# Altium schematic sheet 06 ethernet.SchDoc
size A3; SheetNumber: 10; SheetTotal: 16
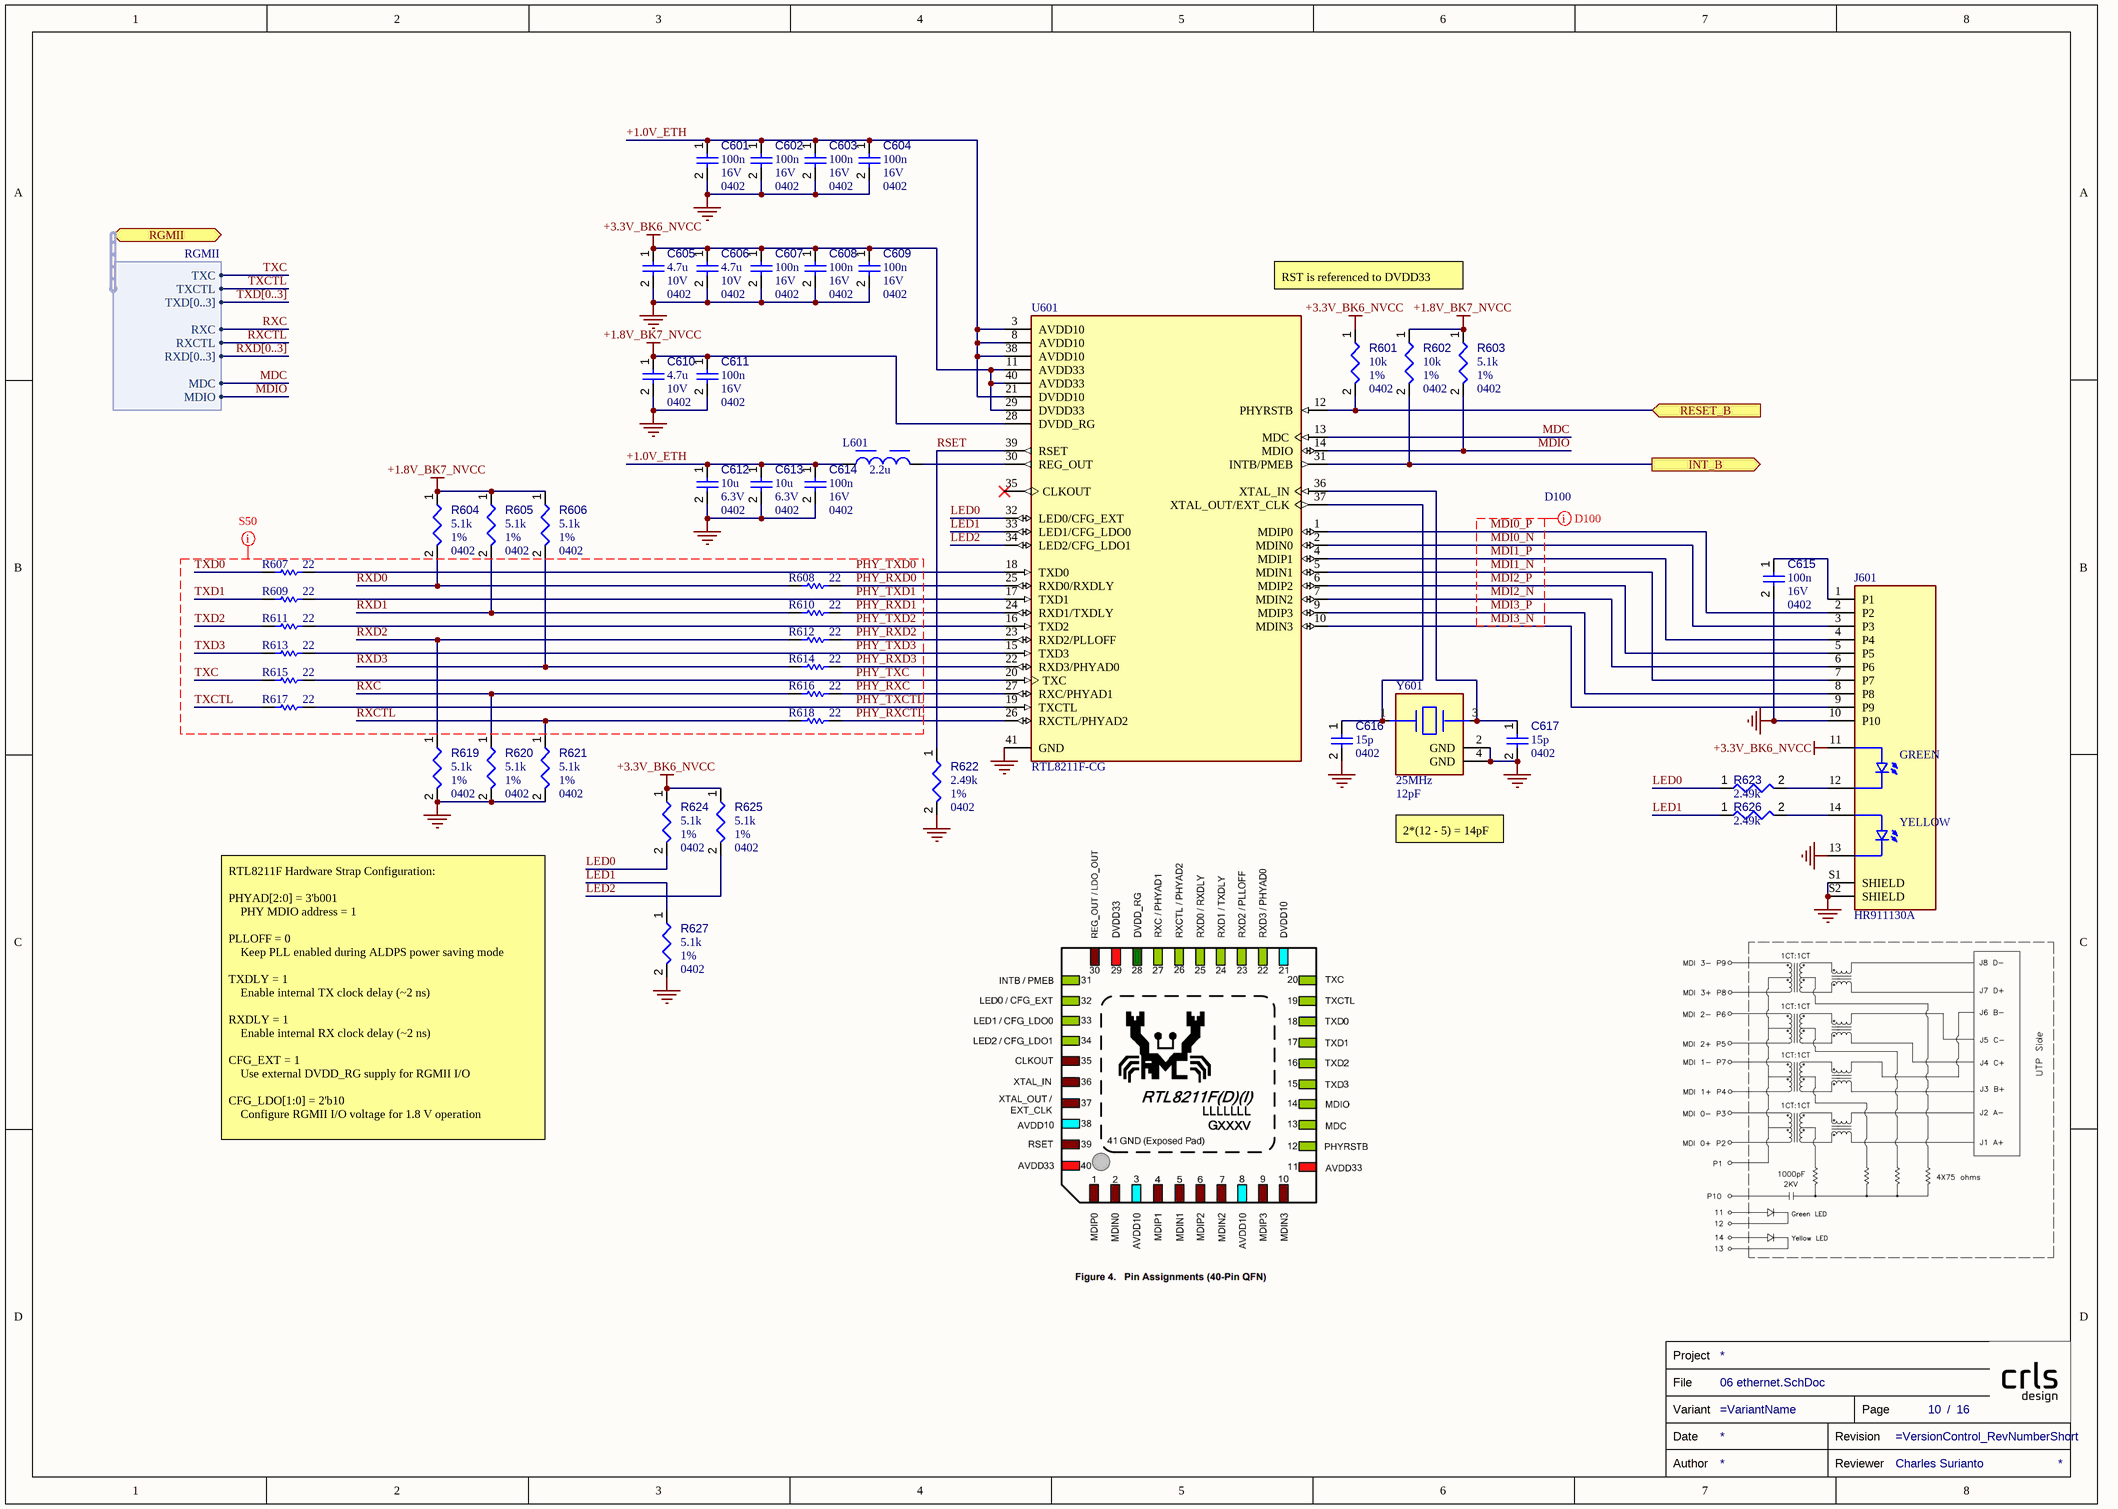
[diagram p0: 06 ethernet.SchDoc]

## Parts
C601  value 100n  Case/Package: 0402  Voltage Rating: 16V  [CAPC0402(1005)60_L]  (hidden comment: Capacitors,0402,100n,16V)
C602  value 100n  Case/Package: 0402  Voltage Rating: 16V  [CAPC0402(1005)60_L]  (hidden comment: Capacitors,0402,100n,16V)
C603  value 100n  Case/Package: 0402  Voltage Rating: 16V  [CAPC0402(1005)60_L]  (hidden comment: Capacitors,0402,100n,16V)
C604  value 100n  Case/Package: 0402  Voltage Rating: 16V  [CAPC0402(1005)60_L]  (hidden comment: Capacitors,0402,100n,16V)
C605  value 4.7u  Case/Package: 0402  Voltage Rating: 10V  [CAPC0402(1005)60_L]  (hidden comment: Capacitors,0402,4.7u,10V)
C606  value 4.7u  Case/Package: 0402  Voltage Rating: 10V  [CAPC0402(1005)60_L]  (hidden comment: Capacitors,0402,4.7u,10V)
C607  value 100n  Case/Package: 0402  Voltage Rating: 16V  [CAPC0402(1005)60_L]  (hidden comment: Capacitors,0402,100n,16V)
C608  value 100n  Case/Package: 0402  Voltage Rating: 16V  [CAPC0402(1005)60_L]  (hidden comment: Capacitors,0402,100n,16V)
C609  value 100n  Case/Package: 0402  Voltage Rating: 16V  [CAPC0402(1005)60_L]  (hidden comment: Capacitors,0402,100n,16V)
C610  value 4.7u  Case/Package: 0402  Voltage Rating: 10V  [CAPC0402(1005)60_L]  (hidden comment: Capacitors,0402,4.7u,10V)
C611  value 100n  Case/Package: 0402  Voltage Rating: 16V  [CAPC0402(1005)60_L]  (hidden comment: Capacitors,0402,100n,16V)
C612  value 10u  Case/Package: 0402  Voltage Rating: 6.3V  [CAPC0402(1005)60_L]  (hidden comment: Capacitors,0402,10u,6.3V)
C613  value 10u  Case/Package: 0402  Voltage Rating: 6.3V  [CAPC0402(1005)60_L]  (hidden comment: Capacitors,0402,10u,6.3V)
C614  value 100n  Case/Package: 0402  Voltage Rating: 16V  [CAPC0402(1005)60_L]  (hidden comment: Capacitors,0402,100n,16V)
C615  value 100n  Case/Package: 0402  Voltage Rating: 16V  [CAPC0402(1005)60_L]  (hidden comment: Capacitors,0402,100n,16V)
C616  value 15p  Case/Package: 0402  [CAPC0402(1005)60_L]  (hidden comment: Capacitors,0402,15p)
C617  value 15p  Case/Package: 0402  [CAPC0402(1005)60_L]  (hidden comment: Capacitors,0402,15p)
J601  HR911130A  [HANRUN_HR911130A]
L601  Inductance: 2.2u  [WE-LQS_3015]  (hidden comment: 74404032022)
R601  value 10k  Case/Package: 0402  Tolerance: 1%  [RESC0402(1005)_L]  (hidden comment: Resistors,0402,1%,10k)
R602  value 10k  Case/Package: 0402  Tolerance: 1%  [RESC0402(1005)_L]  (hidden comment: Resistors,0402,1%,10k)
R603  value 5.1k  Case/Package: 0402  Tolerance: 1%  [RESC0402(1005)_L]  (hidden comment: Resistors,0402,1%,5.1k)
R604  value 5.1k  Case/Package: 0402  Tolerance: 1%  [RESC0402(1005)_L]  (hidden comment: Resistors,0402,1%,5.1k)
R605  value 5.1k  Case/Package: 0402  Tolerance: 1%  [RESC0402(1005)_L]  (hidden comment: Resistors,0402,1%,5.1k)
R606  value 5.1k  Case/Package: 0402  Tolerance: 1%  [RESC0402(1005)_L]  (hidden comment: Resistors,0402,1%,5.1k)
R607  value 22  [RESC0201(0603)_L]  (hidden comment: 22R 1% 0201(0603))
R608  value 22  [RESC0201(0603)_L]  (hidden comment: 22R 1% 0201(0603))
R609  value 22  [RESC0201(0603)_L]  (hidden comment: 22R 1% 0201(0603))
R610  value 22  [RESC0201(0603)_L]  (hidden comment: 22R 1% 0201(0603))
R611  value 22  [RESC0201(0603)_L]  (hidden comment: 22R 1% 0201(0603))
R612  value 22  [RESC0201(0603)_L]  (hidden comment: 22R 1% 0201(0603))
R613  value 22  [RESC0201(0603)_L]  (hidden comment: 22R 1% 0201(0603))
R614  value 22  [RESC0201(0603)_L]  (hidden comment: 22R 1% 0201(0603))
R615  value 22  [RESC0201(0603)_L]  (hidden comment: 22R 1% 0201(0603))
R616  value 22  [RESC0201(0603)_L]  (hidden comment: 22R 1% 0201(0603))
R617  value 22  [RESC0201(0603)_L]  (hidden comment: 22R 1% 0201(0603))
R618  value 22  [RESC0201(0603)_L]  (hidden comment: 22R 1% 0201(0603))
R619  value 5.1k  Case/Package: 0402  Tolerance: 1%  [RESC0402(1005)_L]  (hidden comment: Resistors,0402,1%,5.1k)
R620  value 5.1k  Case/Package: 0402  Tolerance: 1%  [RESC0402(1005)_L]  (hidden comment: Resistors,0402,1%,5.1k)
R621  value 5.1k  Case/Package: 0402  Tolerance: 1%  [RESC0402(1005)_L]  (hidden comment: Resistors,0402,1%,5.1k)
R622  value 2.49k  Case/Package: 0402  Tolerance: 1%  [RESC0402(1005)_L]  (hidden comment: Resistors,0402,1%,2.49k)
R623  value 2.49k  [RESC0402(1005)_L]  (hidden comment: Resistors,0402,1%,2.49k)
R624  value 5.1k  Case/Package: 0402  Tolerance: 1%  [RESC0402(1005)_L]  (hidden comment: Resistors,0402,1%,5.1k)
R625  value 5.1k  Case/Package: 0402  Tolerance: 1%  [RESC0402(1005)_L]  (hidden comment: Resistors,0402,1%,5.1k)
R626  value 2.49k  [RESC0402(1005)_L]  (hidden comment: Resistors,0402,1%,2.49k)
R627  value 5.1k  Case/Package: 0402  Tolerance: 1%  [RESC0402(1005)_L]  (hidden comment: Resistors,0402,1%,5.1k)
TB?  Reviewer: Charles Surianto  (hidden comment: TITLE_BLOCK)  (graphical)
U601  RTL8211F-CG  [QFN40P500X500X90-41N]
Y601  Frequency: 25MHz  Load Capacitance: 12pF  [FP-TSX-3225-MFG]  (hidden comment: TSX-3225 25.0000MF10P-C0)

## Ports
INT_B (out), RESET_B (in), RGMII (bidir, harness RGMII)

## Harnesses
RGMII: TXC, TXCTL, TXD[0..3], RXC, RXCTL, RXD[0..3], MDIO, MDC

## Nets
+1.8V_BK7_NVCC: C610.1 C611.1 R602.1 R603.1 R604.1 R605.1 R606.1 U601.28(DVDD_RG)
+3.3V_BK6_NVCC: C605.1 C606.1 C607.1 C608.1 C609.1 J601.11 R601.1 R624.1 R625.1 U601.11(AVDD33) U601.29(DVDD33) U601.40(AVDD33)
GND: C601.2 C602.2 C603.2 C604.2 C605.2 C606.2 C607.2 C608.2 C609.2 C610.2 C611.2 C612.2 C613.2 C614.2 C615.2 C616.2 C617.2 J601.10(P10) J601.13 J601.S1(SHIELD) J601.S2(SHIELD) R619.2 R620.2 R621.2 R622.2 R627.2 U601.41(GND) Y601.2(GND) Y601.4(GND)
+1.0V_ETH: C601.1 C602.1 C603.1 C604.1 C612.1 C613.1 C614.1 L601.1 U601.3(AVDD10) U601.8(AVDD10) U601.21(DVDD10) U601.38(AVDD10)
INT_B: R602.2 U601.31(INTB/PMEB) ; port INT_B
LED0: R623.1 R624.2 U601.32(LED0/CFG_EXT)
LED1: R626.1 R627.1 U601.33(LED1/CFG_LDO0)
LED2: R625.2 U601.34(LED2/CFG_LDO1)
MDC: U601.13(MDC) ; port RGMII.MDC
MDI0_N: J601.3(P3) U601.2(MDIN0)
MDI0_P: J601.2(P2) U601.1(MDIP0)
MDI1_N: J601.7(P7) U601.5(MDIN1)
MDI1_P: J601.4(P4) U601.4(MDIP1)
MDI2_N: J601.6(P6) U601.7(MDIN2)
MDI2_P: J601.5(P5) U601.6(MDIP2)
MDI3_N: J601.9(P9) U601.10(MDIN3)
MDI3_P: J601.8(P8) U601.9(MDIP3)
MDIO: R603.2 U601.14(MDIO) ; port RGMII.MDIO
PHY_RXC: R616.2 U601.27(RXC/PHYAD1)
PHY_RXCTL: R618.2 U601.26(RXCTL/PHYAD2)
PHY_RXD0: R608.2 U601.25(RXD0/RXDLY)
PHY_RXD1: R610.2 U601.24(RXD1/TXDLY)
PHY_RXD2: R612.2 U601.23(RXD2/PLLOFF)
PHY_RXD3: R614.2 U601.22(RXD3/PHYAD0)
PHY_TXC: R615.2 U601.20(TXC)
PHY_TXCTL: R617.2 U601.19(TXCTL)
PHY_TXD0: R607.2 U601.18(TXD0)
PHY_TXD1: R609.2 U601.17(TXD1)
PHY_TXD2: R611.2 U601.16(TXD2)
PHY_TXD3: R613.2 U601.15(TXD3)
RESET_B: R601.2 U601.12(PHYRSTB) ; port RESET_B
RSET: R622.1 U601.39(RSET)
RXC: R616.1 R620.1 ; port RGMII.RXC
RXCTL: R618.1 R621.1 ; port RGMII.RXCTL
RXD0: R604.2 R608.1
RXD1: R605.2 R610.1
RXD2: R612.1 R619.1
RXD3: R606.2 R614.1
TXC: R615.1 ; port RGMII.TXC
TXCTL: R617.1 ; port RGMII.TXCTL
TXD0: R607.1
TXD1: R609.1
TXD2: R611.1
TXD3: R613.1
NetC615_1: C615.1 J601.1(P1)
NetC616_1: C616.1 U601.37(XTAL_OUT/EXT_CLK) Y601.1
NetC617_1: C617.1 U601.36(XTAL_IN) Y601.3
NetJ601_12: J601.12 R623.2
NetJ601_14: J601.14 R626.2
NetL601_2: L601.2 U601.30(REG_OUT)

Not connected (* = marked no-connect by the designer): U601 35(CLKOUT)*

## Buses and harness runs
bus RXD[0..3]
bus TXD[0..3]

## Layout directives
differential pair; differential pair class D100: MDI0_N, MDI0_P, MDI1_N, MDI1_P, MDI2_N, MDI2_P, MDI3_N, MDI3_P
net class S50: PHY_RXC, PHY_RXCTL, PHY_RXD0, PHY_RXD1, PHY_RXD2, PHY_RXD3, PHY_TXC, PHY_TXCTL, PHY_TXD0, PHY_TXD1, PHY_TXD2, PHY_TXD3, RXC, RXCTL, RXD0, RXD1, RXD2, RXD3, TXC, TXCTL, TXD0, TXD1, TXD2, TXD3

## Notes on the sheet
- RST is referenced to DVDD33
- 2*(12 - 5) = 14pF
- RTL8211F Hardware Strap Configuration:
  PHYAD[2:0] = 3'b001
  PHY MDIO address = 1
  PLLOFF = 0
  Keep PLL enabled during ALDPS power saving mode
  TXDLY = 1
  Enable internal TX clock delay (~2 ns)
  RXDLY = 1
  Enable internal RX clock delay (~2 ns)
  CFG_EXT = 1
  Use external DVDD_RG supply for RGMII I/O
  CFG_LDO[1:0] = 2'b10
  Configure RGMII I/O voltage for 1.8 V operation
- (in symbol HR911130A) GREEN; YELLOW
- (in symbol TITLE_BLOCK) Project; File; Variant; Page; /; Date; Revision; Author; Reviewer

## Library data of the parts
C601-C617 = Capacitors: Capacitor; Component Type: Capacitors
J601 = HR911130A: MF: hanrun; SnapEDA_Link: https://www.snapeda.com/parts/HR911130A/HanRun/view-part/?ref=snap; Package: None; Value: *; MP: HR911130A; Check_prices: https://www.snapeda.com/parts/HR911130A/HanRun/view-part/?ref=eda
L601 = CMP-1354-00022-3: Fixed Ind 2.2UH 1.8A 50 Mohm SMD; Self Resonant Frequency: 75MHz; Core Material: Ferrite; Test Frequency: 100kHz; Shielding: Shielded; Saturation Current: 1.7A; DC Resistance (DCR): 50mΩ; Inductance Tolerance: 20%; Max Operating Temperature: 125°C; Case/Package: Nonstandard; Ambient Temperature Range High: 85°C; Termination: SMD/SMT; RoHS: Compliant; Height - Seated (Max): 1.4986mm; REACH SVHC: Unknown; Mount: Surface Mount; Composition: Wirewound; Length: 3mm; Max DC Current: 1.8A; Current Rating: 1.8A; Width: 3mm; Height: 1.5mm; RMS Current (Irms): 1.8A; Ambient Temperature Range Low: -40°C; Tolerance: 20%; Min Operating Temperature: -40°C
R601-R606 R619-R627 = Resistors: Resistor; Component Type: Resistors
  R623 R626: Case/Package: 0402; Tolerance: 1%
R607-R618 = CMP-1010-00226-1: 22R 0.05W 1% 0201 (0603 Metric)  SMD; Case-EIA: 0201; Case-Metric: 0603; Technology: SMT; Power: 0.05 W; Tolerance: 1 %
U601 = RTL8211F-CG: GbE PHY with RGMIII interface & EEE feature (Switch Regulator), QFN40; MF: Realtek Semiconductor Corp; SnapEDA_Link: https://www.snapeda.com/parts/RTL8211F-CG/Realtek/view-part/?ref=snap; Package: None; Value: *; MP: RTL8211F-CG; Check_prices: https://www.snapeda.com/parts/RTL8211F-CG/Realtek/view-part/?ref=eda
Y601 = CMP-36405-000019-1: CRYSTAL 25.0000MHZ 18PF SMD; ESR (Equivalent Series Resistance): 40R; Frequency Stability: 10ppm; Max Operating Temperature: 85°C; Length: 3.2mm; Packaging: Tape and Reel; Min Operating Temperature: -20°C; Depth: 2.5mm; Case/Package: SMD/SMT; Number of Pins: 4
TB? = TITLE_BLOCK: Review Date: *